# EAGLE schematic espduino-12-panel (EAGLE 7.1.0)
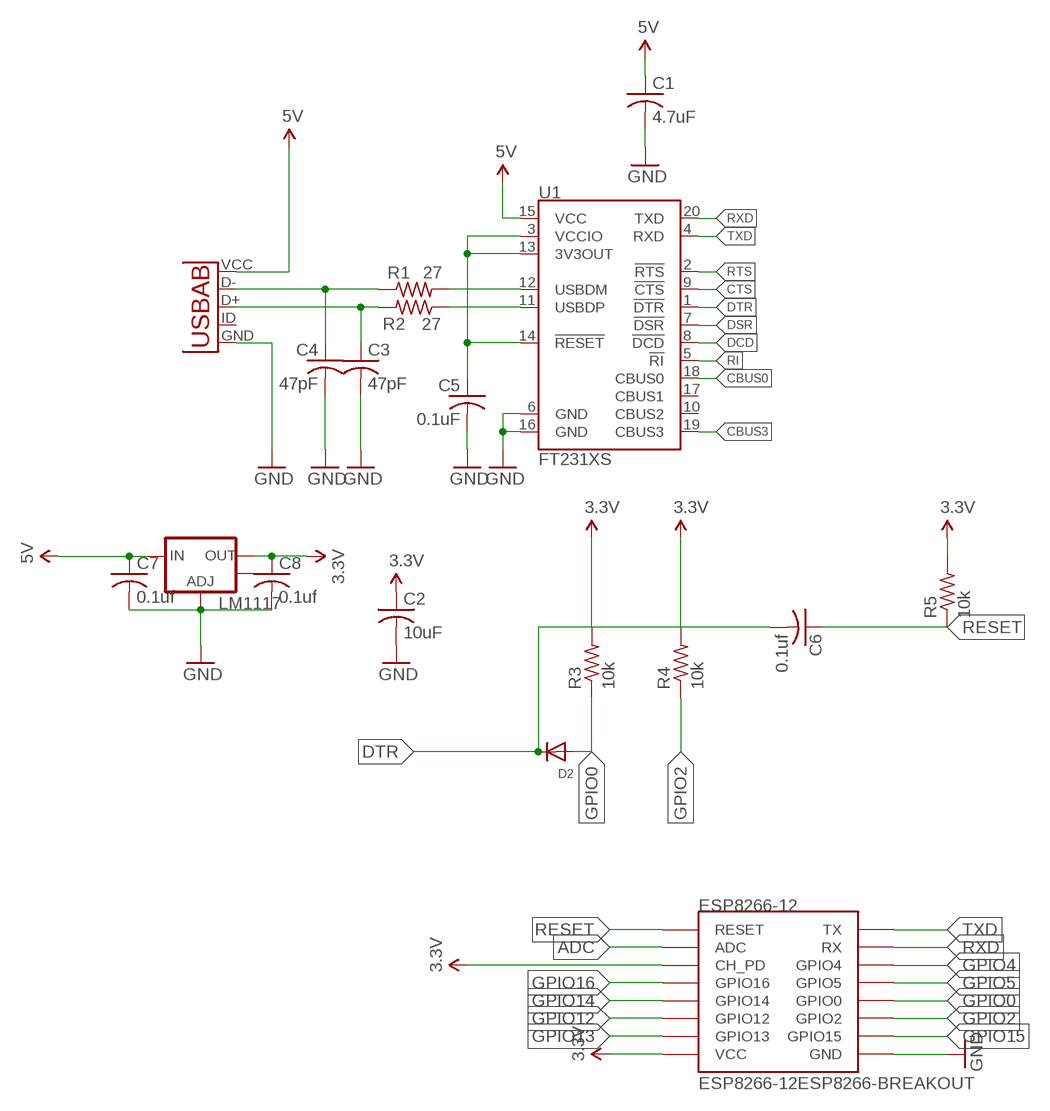
[diagram p0: schematic, sheet 1]

## Parts
C1  4.7uF  C-USC0603  [C0603]
C2  10uF  C-USC0603  [C0603]
C3  47pF  C-USC0603  [C0603]
C4  47pF  C-USC0603  [C0603]
C5  0.1uF  C-USC0603  [C0603]
C6  0.1uf  C-USC0603  [C0603]
C7  0.1uf  C-USC0603  [C0603]
C8  0.1uf  C-USC0603  [C0603]
D2  DIODESOT23_REFLOW  [SOT23-R]
ESP8266-12  ESP8266-12ESP8266-BREAKOUT  [ESP8266-12-EXT-HEADERS]
LM1117  V_REG_LM1117SOT223  [SOT223]
R1  27  R-US_R0603  [R0603]
R2  27  R-US_R0603  [R0603]
R3  10k  R-US_R0603  [R0603]
R4  10k  R-US_R0603  [R0603]
R5  10k  R-US_R0603  [R0603]
U1  FT231XS  [SSOP20_L]
U2  USB-AB  [MICRO-USB-A01SB141B1]

## Nets
3.3V [POWER]: C2.1 C8.1 ESP8266-12.CH_PD ESP8266-12.VCC ESP8266-12.VCC_P(VCC) LM1117.2(OUT) R3.2 R4.2 R5.2
5V [POWER]: C1.1 C7.1 LM1117.3(IN) U1.15(VCC) U2.VCC(VBUS)
ADC: ESP8266-12.ADC ESP8266-12.ADC_P(ADC)
CBUS0: U1.18(CBUS0)
CBUS3: U1.19(CBUS3)
CTS: U1.9(!CTS)
DCD: U1.8(!DCD)
DSR: U1.7(!DSR)
DTR: C6.2 D2.3(C) U1.1(!DTR)
GND [POWER]: C1.2 C2.2 C3.2 C4.2 C5.2 C7.2 C8.2 ESP8266-12.GND ESP8266-12.GND_P(GND) LM1117.1(ADJ) U1.6(GND) U1.16(GND) U2.GND
GPIO0: D2.1(A) ESP8266-12.GPIO0 ESP8266-12.GPIO0_P(GPIO0) R3.1
GPIO2: ESP8266-12.GPIO2 ESP8266-12.GPIO2_P(GPIO2) R4.1
GPIO4: ESP8266-12.GPIO4 ESP8266-12.GPIO4_P(GPIO4)
GPIO5: ESP8266-12.GPIO5 ESP8266-12.GPIO5_P(GPIO5)
GPIO12: ESP8266-12.GPIO12 ESP8266-12.GPIO12_P(GPIO12)
GPIO13: ESP8266-12.GPIO13 ESP8266-12.GPIO13_P(GPIO13)
GPIO14: ESP8266-12.GPIO14 ESP8266-12.GPIO14_P(GPIO14)
GPIO15: ESP8266-12.GPIO15 ESP8266-12.GPIO15_P(GPIO15)
GPIO16: ESP8266-12.GPIO16 ESP8266-12.GPIO_16_P(GPIO16)
N$1: R1.2 U1.12(USBDM)
N$2: R2.1 U1.11(USBDP)
N$3: C3.1 R2.2 U2.D+
N$4: C4.1 R1.1 U2.D-
N$5 [POWER]: C5.1 U1.3(VCCIO) U1.13(3V3OUT) U1.14(!RESET)
RESET: C6.1 ESP8266-12.RESET R5.1
RI: U1.5(!RI)
RTS: U1.2(!RTS)
RXD: ESP8266-12.RX U1.20(TXD)
TXD: ESP8266-12.TX U1.4(RXD)
Unconnected: LM1117.4(OUT) U1.10(CBUS2) U1.17(CBUS1) U2.ID(USBID)

## Library data of the parts
C1-C8 = resistor:C-US: CAPACITOR, American symbol
D2 = adafruit:DIODE: Diode SMADIODE - SMA Surface Mount Package 20V 1A Schottky Diode Digikey: 641-1014-6-ND DO-1N4148 - Through Hole Small Current Diode SOD-123 20V 1 A (.5mV Vf) Schottky Diode - Digikey: MBRX120TPMSCT-ND SOD-323 10V 570mA (.38mV Vf, 3ns) Schottky Diode - Digikey: ZLLS410CT-ND SOD-523 30V 30mA Schottky Diode (RB751S-40TE61) - Digikey: RB751S-40TE61CT-ND SOT23-R/W - SOT23 Package (R = Solder Paste/Reflow Ovens, W = Hand-Soldering) BAT54Film 40V 300mA - Digikey: 497-7162-1-ND
ESP8266-12 = jumper-parts:ESP8266-12: ESP8266 Wifi module 12
LM1117 = SparkFun-PowerIC:V_REG_LM1117: Voltage Regulator LM1117 Standard adjustable voltage regulator but in SMD form. Spark Fun Electronics SKU : COM-00595; PROD_ID: VREG-08170
R1-R5 = resistor:R-US_: RESISTOR, American symbol
U1 = SparkFun-DigitalIC:FT231X: FTDI FT231X Full Speed USB to Full-handshake UART This USB2.0 Full Speed IC offers a compact bridge to full handshake UART interfaces. The device is a UART, capable of operating up to 3MBaud, with low power consumption (8mA). The FT231X includes the complete FT-X series feature set and enables USB to be added into a system design quickly and easily over a UART interface.
U2 = jumper-parts:USB-AB: This is a USB AB connector that is compatible with USB OTG. i.e. this connector can serve as a host or device

## Net classes
0 default: width 0.254 mm
1 POWER: width 0.406 mm